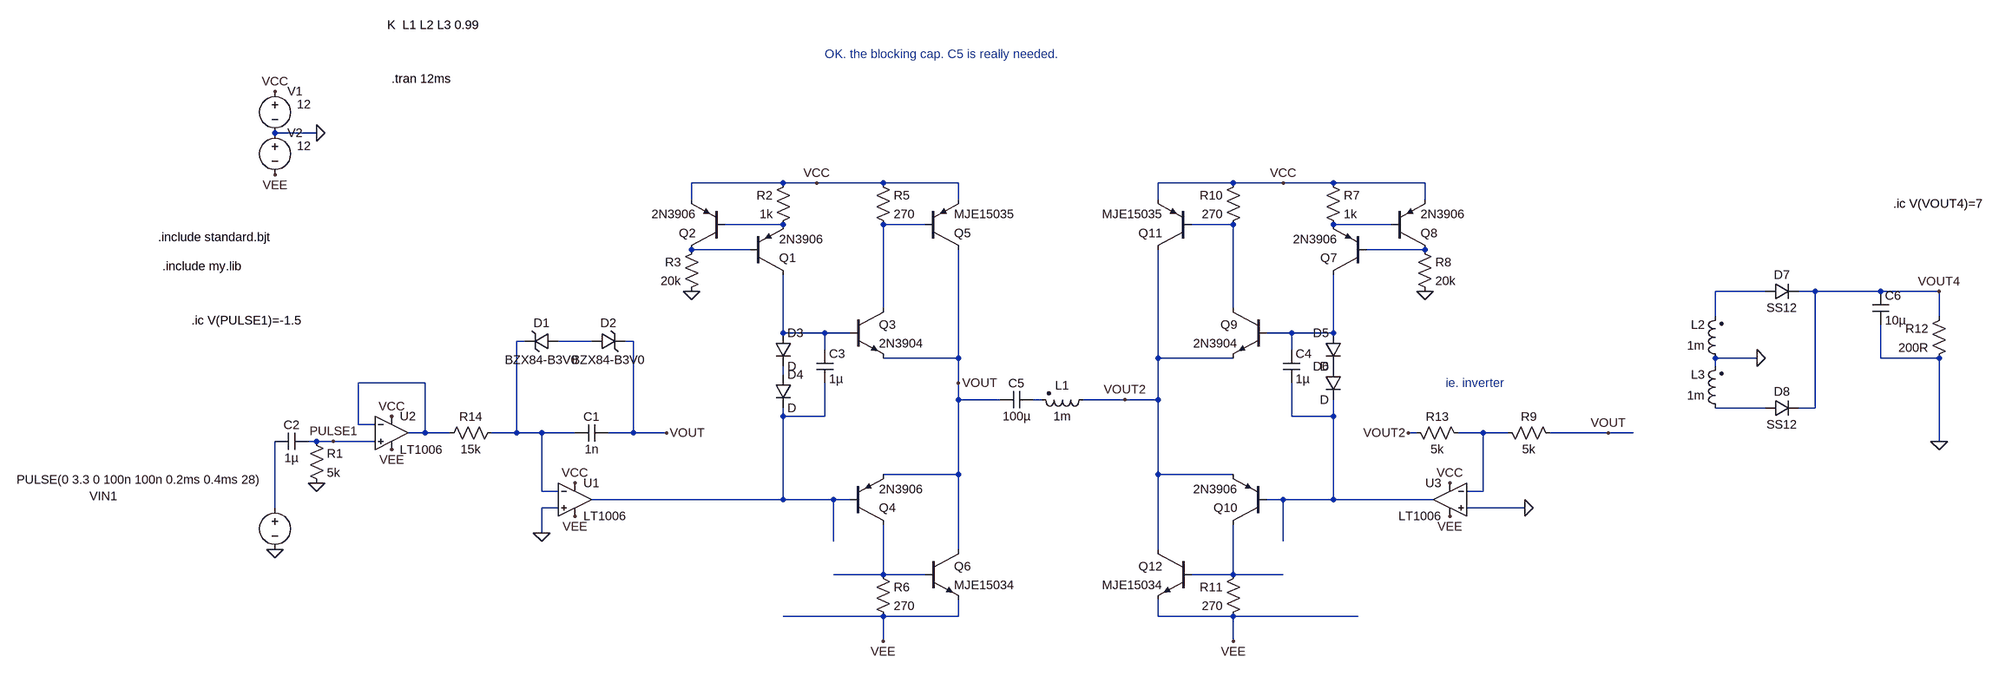
[diagram p0: schematic Draft103.asc]
Draft103.asc, the LTspice schematic file:
Version 4
SHEET 1 3872 1956
WIRE 544 -288 464 -288
WIRE 1440 -192 1264 -192
WIRE 1504 -192 1440 -192
WIRE 1632 -192 1504 -192
WIRE 1776 -192 1632 -192
WIRE 2304 -192 2160 -192
WIRE 2400 -192 2304 -192
WIRE 2496 -192 2400 -192
WIRE 2672 -192 2496 -192
WIRE 1264 -160 1264 -192
WIRE 1776 -160 1776 -192
WIRE 2160 -160 2160 -192
WIRE 2672 -160 2672 -192
WIRE 1440 -112 1328 -112
WIRE 1712 -112 1632 -112
WIRE 2304 -112 2224 -112
WIRE 2608 -112 2496 -112
WIRE 1376 -64 1264 -64
WIRE 2672 -64 2560 -64
WIRE 3424 16 3328 16
WIRE 3520 16 3488 16
WIRE 3664 16 3520 16
WIRE 3776 16 3664 16
WIRE 1632 48 1632 -112
WIRE 2304 48 2304 -112
WIRE 3328 64 3328 16
WIRE 3776 64 3776 16
WIRE 1440 96 1440 -16
WIRE 1520 96 1440 96
WIRE 1568 96 1520 96
WIRE 2416 96 2368 96
WIRE 2496 96 2496 -16
WIRE 2496 96 2416 96
WIRE 944 112 928 112
WIRE 1072 112 1008 112
WIRE 1152 112 1136 112
WIRE 1520 128 1520 96
WIRE 2416 128 2416 96
WIRE 1776 144 1776 -64
WIRE 1776 144 1632 144
WIRE 2160 144 2160 -64
WIRE 2304 144 2160 144
WIRE 3408 144 3328 144
WIRE 3664 144 3664 80
WIRE 3776 144 3664 144
WIRE 3328 160 3328 144
WIRE 1440 176 1440 160
WIRE 752 192 624 192
WIRE 1776 192 1776 144
WIRE 1776 224 1776 192
WIRE 1856 224 1776 224
WIRE 1936 224 1920 224
WIRE 2096 224 2016 224
WIRE 2160 224 2160 144
WIRE 2160 224 2096 224
WIRE 3424 240 3328 240
WIRE 3520 240 3520 16
WIRE 3520 240 3488 240
WIRE 1440 256 1440 240
WIRE 1520 256 1520 192
WIRE 1520 256 1440 256
WIRE 2416 256 2416 192
WIRE 2496 256 2496 224
WIRE 2496 256 2416 256
WIRE 624 272 624 192
WIRE 656 272 624 272
WIRE 752 288 752 192
WIRE 752 288 720 288
WIRE 800 288 752 288
WIRE 928 288 928 112
WIRE 928 288 880 288
WIRE 976 288 928 288
WIRE 1040 288 976 288
WIRE 1152 288 1152 112
WIRE 1152 288 1104 288
WIRE 1216 288 1152 288
WIRE 2656 288 2640 288
WIRE 2784 288 2736 288
WIRE 2832 288 2784 288
WIRE 3024 288 2912 288
WIRE 3072 288 3024 288
WIRE 544 304 528 304
WIRE 576 304 544 304
WIRE 656 304 576 304
WIRE 3776 304 3776 144
WIRE 1776 368 1776 224
WIRE 1776 368 1632 368
WIRE 2160 368 2160 224
WIRE 2304 368 2160 368
WIRE 976 400 976 288
WIRE 1008 400 976 400
WIRE 2784 400 2784 288
WIRE 2784 400 2752 400
WIRE 1440 416 1440 256
WIRE 1440 416 1072 416
WIRE 1536 416 1440 416
WIRE 1568 416 1536 416
WIRE 2400 416 2368 416
WIRE 2496 416 2496 256
WIRE 2496 416 2400 416
WIRE 2688 416 2496 416
WIRE 464 432 464 304
WIRE 1008 432 976 432
WIRE 2864 432 2752 432
WIRE 976 480 976 432
WIRE 1536 496 1536 416
WIRE 2400 496 2400 416
WIRE 1776 512 1776 368
WIRE 2160 512 2160 368
WIRE 1632 560 1632 464
WIRE 1632 560 1536 560
WIRE 1712 560 1632 560
WIRE 2304 560 2304 464
WIRE 2304 560 2224 560
WIRE 2400 560 2304 560
WIRE 1632 640 1440 640
WIRE 1776 640 1776 608
WIRE 1776 640 1632 640
WIRE 2160 640 2160 608
WIRE 2304 640 2160 640
WIRE 2544 640 2304 640
WIRE 1632 688 1632 640
WIRE 2304 688 2304 640
FLAG 464 -368 VCC
FLAG 464 512 0
FLAG 544 -288 0
FLAG 976 480 0
FLAG 1040 384 VCC
FLAG 1216 288 VOUT
FLAG 464 -208 VEE
FLAG 1040 448 VEE
FLAG 688 256 VCC
FLAG 688 320 VEE
FLAG 544 384 0
FLAG 576 304 PULSE1
FLAG 1776 192 VOUT
FLAG 1504 -192 VCC
FLAG 1264 16 0
FLAG 2096 224 VOUT2
FLAG 2400 -192 VCC
FLAG 2720 384 VCC
FLAG 2672 16 0
FLAG 2640 288 VOUT2
FLAG 3024 288 VOUT
FLAG 2864 432 0
FLAG 2720 448 VEE
FLAG 2304 688 VEE
FLAG 1632 688 VEE
FLAG 3408 144 0
FLAG 3776 304 0
FLAG 3776 16 VOUT4
SYMBOL voltage 464 -384 R0
WINDOW 123 0 0 Left 0
WINDOW 39 0 0 Left 0
WINDOW 3 42 41 Left 2
SYMATTR Value 12
SYMATTR InstName V1
SYMBOL voltage 464 416 R0
WINDOW 123 0 0 Left 0
WINDOW 39 0 0 Left 0
WINDOW 3 -496 -38 Left 2
WINDOW 0 -356 -7 Left 2
SYMATTR Value PULSE(0 3.3 0 100n 100n 0.2ms 0.4ms 28)
SYMATTR InstName VIN1
SYMBOL res 784 304 R270
WINDOW 0 32 56 VTop 2
WINDOW 3 0 56 VBottom 2
SYMATTR InstName R14
SYMATTR Value 15k
SYMBOL cap 1104 272 R90
WINDOW 0 0 32 VBottom 2
WINDOW 3 32 32 VTop 2
SYMATTR InstName C1
SYMATTR Value 1n
SYMBOL voltage 464 -304 R0
WINDOW 123 0 0 Left 0
WINDOW 39 0 0 Left 0
WINDOW 3 42 41 Left 2
SYMATTR Value 12
SYMATTR InstName V2
SYMBOL zener 1008 96 R90
WINDOW 0 -4 32 VBottom 2
WINDOW 3 36 32 VTop 2
SYMATTR InstName D1
SYMATTR Value BZX84-B3V0
SYMATTR Description Diode
SYMATTR Type diode
SYMBOL zener 1072 128 R270
WINDOW 0 36 32 VTop 2
WINDOW 3 -4 32 VBottom 2
SYMATTR InstName D2
SYMATTR Value BZX84-B3V0
SYMATTR Description Diode
SYMATTR Type diode
SYMBOL OpAmps\\LT1006 688 224 R0
SYMATTR InstName U2
SYMBOL cap 528 288 R90
WINDOW 0 0 32 VBottom 2
WINDOW 3 32 32 VTop 2
SYMATTR InstName C2
SYMATTR Value 1µ
SYMBOL res 528 288 R0
SYMATTR InstName R1
SYMATTR Value 5k
SYMBOL pnp 1376 -16 M180
SYMATTR InstName Q1
SYMATTR Value 2N3906
SYMBOL pnp 1328 -64 R180
SYMATTR InstName Q2
SYMATTR Value 2N3906
SYMBOL res 1456 -208 M0
SYMATTR InstName R2
SYMATTR Value 1k
SYMBOL res 1280 -80 M0
SYMATTR InstName R3
SYMATTR Value 20k
SYMBOL npn 1568 48 R0
SYMATTR InstName Q3
SYMATTR Value 2N3904
SYMBOL pnp 1568 464 M180
SYMATTR InstName Q4
SYMATTR Value 2N3906
SYMBOL diode 1424 96 R0
SYMATTR InstName D3
SYMBOL diode 1424 176 R0
SYMATTR InstName D4
SYMBOL res 1616 -208 R0
SYMATTR InstName R5
SYMATTR Value 270
SYMBOL res 1616 544 R0
SYMATTR InstName R6
SYMATTR Value 270
SYMBOL pnp 1712 -64 M180
SYMATTR InstName Q5
SYMATTR Value MJE15035
SYMBOL npn 1712 512 R0
SYMATTR InstName Q6
SYMATTR Value MJE15034
SYMBOL pnp 2560 -16 R180
SYMATTR InstName Q7
SYMATTR Value 2N3906
SYMBOL pnp 2608 -64 M180
SYMATTR InstName Q8
SYMATTR Value 2N3906
SYMBOL res 2480 -208 R0
SYMATTR InstName R7
SYMATTR Value 1k
SYMBOL res 2656 -80 R0
SYMATTR InstName R8
SYMATTR Value 20k
SYMBOL npn 2368 48 M0
SYMATTR InstName Q9
SYMATTR Value 2N3904
SYMBOL pnp 2368 464 R180
SYMATTR InstName Q10
SYMATTR Value 2N3906
SYMBOL res 2928 304 M270
WINDOW 0 32 56 VTop 2
WINDOW 3 0 56 VBottom 2
SYMATTR InstName R9
SYMATTR Value 5k
SYMBOL diode 2512 96 M0
SYMATTR InstName D5
SYMBOL diode 2512 160 M0
SYMATTR InstName D6
SYMBOL res 2320 -208 M0
SYMATTR InstName R10
SYMATTR Value 270
SYMBOL res 2320 544 M0
SYMATTR InstName R11
SYMATTR Value 270
SYMBOL pnp 2224 -64 R180
SYMATTR InstName Q11
SYMATTR Value MJE15035
SYMBOL npn 2224 512 M0
SYMATTR InstName Q12
SYMATTR Value MJE15034
SYMBOL res 3792 48 M0
SYMATTR InstName R12
SYMATTR Value 200R
SYMBOL res 2752 304 M270
WINDOW 0 32 56 VTop 2
WINDOW 3 0 56 VBottom 2
SYMATTR InstName R13
SYMATTR Value 5k
SYMBOL ind2 2032 208 R90
WINDOW 0 4 56 VBottom 2
WINDOW 3 32 56 VTop 2
SYMATTR InstName L1
SYMATTR Value 1m
SYMATTR Type ind
SYMBOL ind2 3344 160 R180
WINDOW 0 36 80 Left 2
WINDOW 3 36 40 Left 2
SYMATTR InstName L2
SYMATTR Value 1m
SYMATTR Type ind
SYMBOL cap 1504 128 R0
SYMATTR InstName C3
SYMATTR Value 1µ
SYMBOL cap 2400 128 R0
SYMATTR InstName C4
SYMATTR Value 1µ
SYMBOL cap 1920 208 R90
WINDOW 0 0 32 VBottom 2
WINDOW 3 32 32 VTop 2
SYMATTR InstName C5
SYMATTR Value 100µ
SYMBOL OpAmps\\LT1006 1040 352 R0
SYMATTR InstName U1
SYMBOL OpAmps\\LT1006 2720 352 M0
SYMATTR InstName U3
SYMBOL diode 3424 32 R270
WINDOW 0 32 32 VTop 2
WINDOW 3 0 32 VBottom 2
SYMATTR InstName D7
SYMATTR Value SS12
SYMBOL ind2 3344 256 R180
WINDOW 0 36 80 Left 2
WINDOW 3 36 40 Left 2
SYMATTR InstName L3
SYMATTR Value 1m
SYMATTR Type ind
SYMBOL diode 3424 256 R270
WINDOW 0 32 32 VTop 2
WINDOW 3 0 32 VBottom 2
SYMATTR InstName D8
SYMATTR Value SS12
SYMBOL cap 3648 16 R0
SYMATTR InstName C6
SYMATTR Value 10µ
TEXT 688 -392 Left 2 !.tran 12ms
TEXT 240 -88 Left 2 !.include standard.bjt
TEXT 248 -32 Left 2 !.include my.lib
TEXT 304 72 Left 2 !.ic V(PULSE1)=-1.5
TEXT 2712 192 Left 2 ;ie. inverter
TEXT 680 -496 Left 2 !K  L1 L2 L3 0.99
TEXT 1520 -440 Left 2 ;OK. the blocking cap. C5 is really needed.
TEXT 3688 -152 Left 2 !.ic V(VOUT4)=7

The netlist it stands for:
* Draft103.asc
V1 VCC 0 12
VIN1 N019 0 PULSE(0 3.3 0 100n 100n 0.2ms 0.4ms 28)
R14 N013 N010 15k
C1 VOUT N010 1n
V2 0 VEE 12
D1 N011 N010 BZX84-B3V0
D2 N011 VOUT BZX84-B3V0
XU2 PULSE1 N013 VCC VEE N013 LT1006  ; pins In+ In- V+ V- OUT
C2 PULSE1 N019 1µ
R1 PULSE1 0 5k
Q1 N008 N005 N001 0 2N3906
Q2 N005 N001 VCC 0 2N3906
R2 VCC N001 1k
R3 N005 0 20k
Q3 N002 N008 VOUT 0 2N3904
Q4 N020 N016 VOUT 0 2N3906
D3 N008 N012 D
D4 N012 N016 D
R5 VCC N002 270
R6 N020 VEE 270
Q5 VOUT N002 VCC 0 MJE15035
Q6 VOUT N020 VEE 0 MJE15034
Q7 N009 N006 N004 0 2N3906
Q8 N006 N004 VCC 0 2N3906
R7 VCC N004 1k
R8 N006 0 20k
Q9 N003 N009 VOUT2 0 2N3904
Q10 N021 N017 VOUT2 0 2N3906
R9 VOUT N018 5k
D5 N009 P001 D
D6 P001 N017 D
R10 VCC N003 270
R11 N021 VEE 270
Q11 VOUT2 N003 VCC 0 MJE15035
Q12 VOUT2 N021 VEE 0 MJE15034
R12 VOUT4 0 200R
R13 N018 VOUT2 5k
L1 VOUT2 N014 1m
L2 0 N007 1m
C3 N008 N016 1µ
C4 N009 N017 1µ
C5 N014 VOUT 100µ
XU1 0 N010 VCC VEE N016 LT1006  ; pins In+ In- V+ V- OUT
XU3 0 N018 VCC VEE N017 LT1006  ; pins In+ In- V+ V- OUT
D7 N007 VOUT4 SS12
L3 N015 0 1m
D8 N015 VOUT4 SS12
C6 VOUT4 0 10µ
.model D D
.lib standard.dio
.model NPN NPN
.model PNP PNP
.lib standard.bjt
.tran 12ms
.include standard.bjt
.include my.lib
.ic V(PULSE1)=-1.5
* ie. inverter
K  L1 L2 L3 0.99
* OK. the blocking cap. C5 is really needed.
.ic V(VOUT4)=7
.lib LTC.lib
.backanno
.end